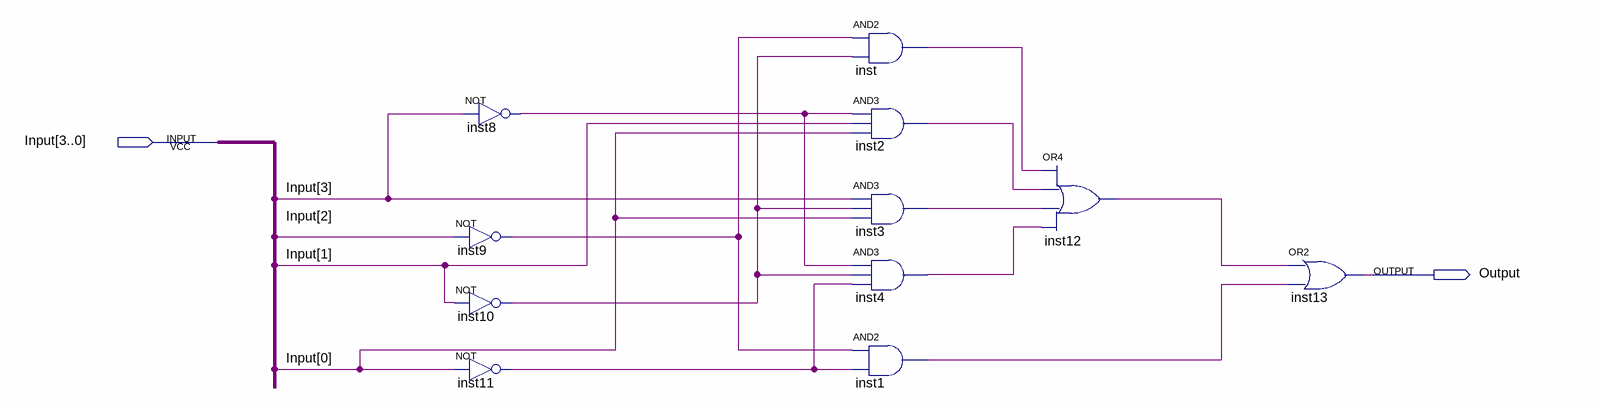
[diagram p0: schematic sheet]
// Quartus schematic display_b.bdf as structural Verilog: 11 symbols, 2 pins
module display_b (
  input  [3:0] Input,
  output Output
);

  wire inst1_out, inst2_out, inst3_out, inst4_out, inst8_out, inst9_out, inst10_out, inst11_out, inst12_out,
       inst_out;

  not inst9 (inst9_out, Input[2]);
  not inst10 (inst10_out, Input[1]);
  not inst11 (inst11_out, Input[0]);
  not inst8 (inst8_out, Input[3]);
  and inst (inst_out, inst9_out, inst10_out);
  and inst2 (inst2_out, inst8_out, Input[1], Input[0]);
  and inst3 (inst3_out, Input[3], inst10_out, Input[0]);
  and inst4 (inst4_out, inst8_out, inst10_out, inst11_out);
  and inst1 (inst1_out, inst9_out, inst11_out);
  or inst12 (inst12_out, inst_out, inst2_out, inst3_out, inst4_out);
  or inst13 (Output, inst12_out, inst1_out);
endmodule
